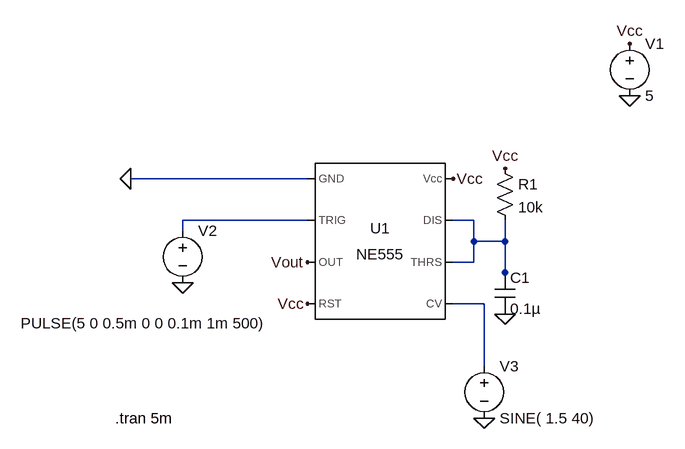
[diagram p0: schematic NE555Controller.asc]
NE555Controller.asc, the LTspice schematic file:
Version 4
SHEET 1 880 680
WIRE 64 208 -208 208
WIRE 64 272 -128 272
WIRE 320 272 288 272
WIRE -128 288 -128 272
WIRE 320 304 320 272
WIRE 368 304 368 272
WIRE 368 304 320 304
WIRE 320 336 320 304
WIRE 320 336 288 336
WIRE 368 352 368 304
WIRE 368 368 368 352
WIRE 336 400 288 400
WIRE 336 496 336 400
FLAG -208 208 0
FLAG 560 80 0
FLAG 560 0 Vcc
FLAG 288 208 Vcc
FLAG 64 400 Vcc
FLAG 64 336 Vout
FLAG 368 416 0
FLAG 368 192 Vcc
FLAG -128 368 0
FLAG 336 576 0
SYMBOL Misc/NE555 176 304 R0
SYMATTR InstName U1
SYMBOL voltage 560 -16 R0
SYMATTR InstName V1
SYMATTR Value 5
SYMBOL cap 352 352 R0
SYMATTR InstName C1
SYMATTR Value 0.1µ
SYMBOL res 352 176 R0
SYMATTR InstName R1
SYMATTR Value 10k
SYMBOL voltage -128 272 R0
WINDOW 3 -249 158 Left 2
SYMATTR InstName V2
SYMATTR Value PULSE(5 0 0.5m 0 0 0.1m 1m 500)
SYMBOL voltage 336 480 R0
SYMATTR InstName V3
SYMATTR Value SINE( 1.5 40)
TEXT -232 576 Left 2 !.tran 5m

The netlist it stands for:
* NE555Controller.asc
XU1 0 N001 Vout Vcc N003 N002 N002 Vcc NE555  ; pins GND TRIG OUT RST CV THRS DIS Vcc
V1 Vcc 0 5
C1 N002 0 0.1µ
R1 Vcc N002 10k
V2 N001 0 PULSE(5 0 0.5m 0 0 0.1m 1m 500)
V3 N003 0 SINE( 1.5 40)
.tran 5m
.lib NE555.sub
.backanno
.end